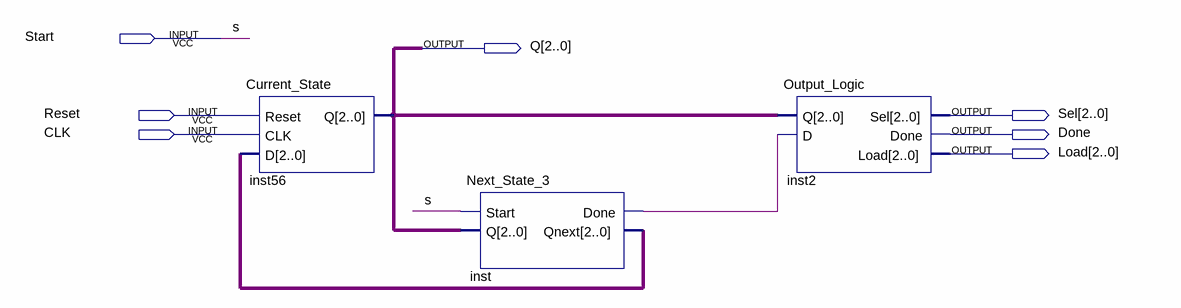
[diagram p0: schematic sheet]
// Quartus schematic Controller_1.bdf as structural Verilog: 3 symbols, 7 pins
module Controller_1 (
  input  Start,
  input  Reset,
  input  CLK,
  output [2:0] Q,
  output [2:0] Sel,
  output Done,
  output [2:0] Load
);

  wire inst_done;
  wire [2:0] inst_qnext;

  Current_State inst56 (.Reset(Reset), .CLK(CLK), .D(inst_qnext), .Q(Q));
  Next_State_3 inst (.Start(Start), .Q(Q), .Done(inst_done), .Qnext(inst_qnext));
  Output_Logic inst2 (.Q(Q), .D(inst_done), .Sel(Sel), .Done(Done), .Load(Load));

  // Other names for the same wires on the sheet: s = Start
endmodule
